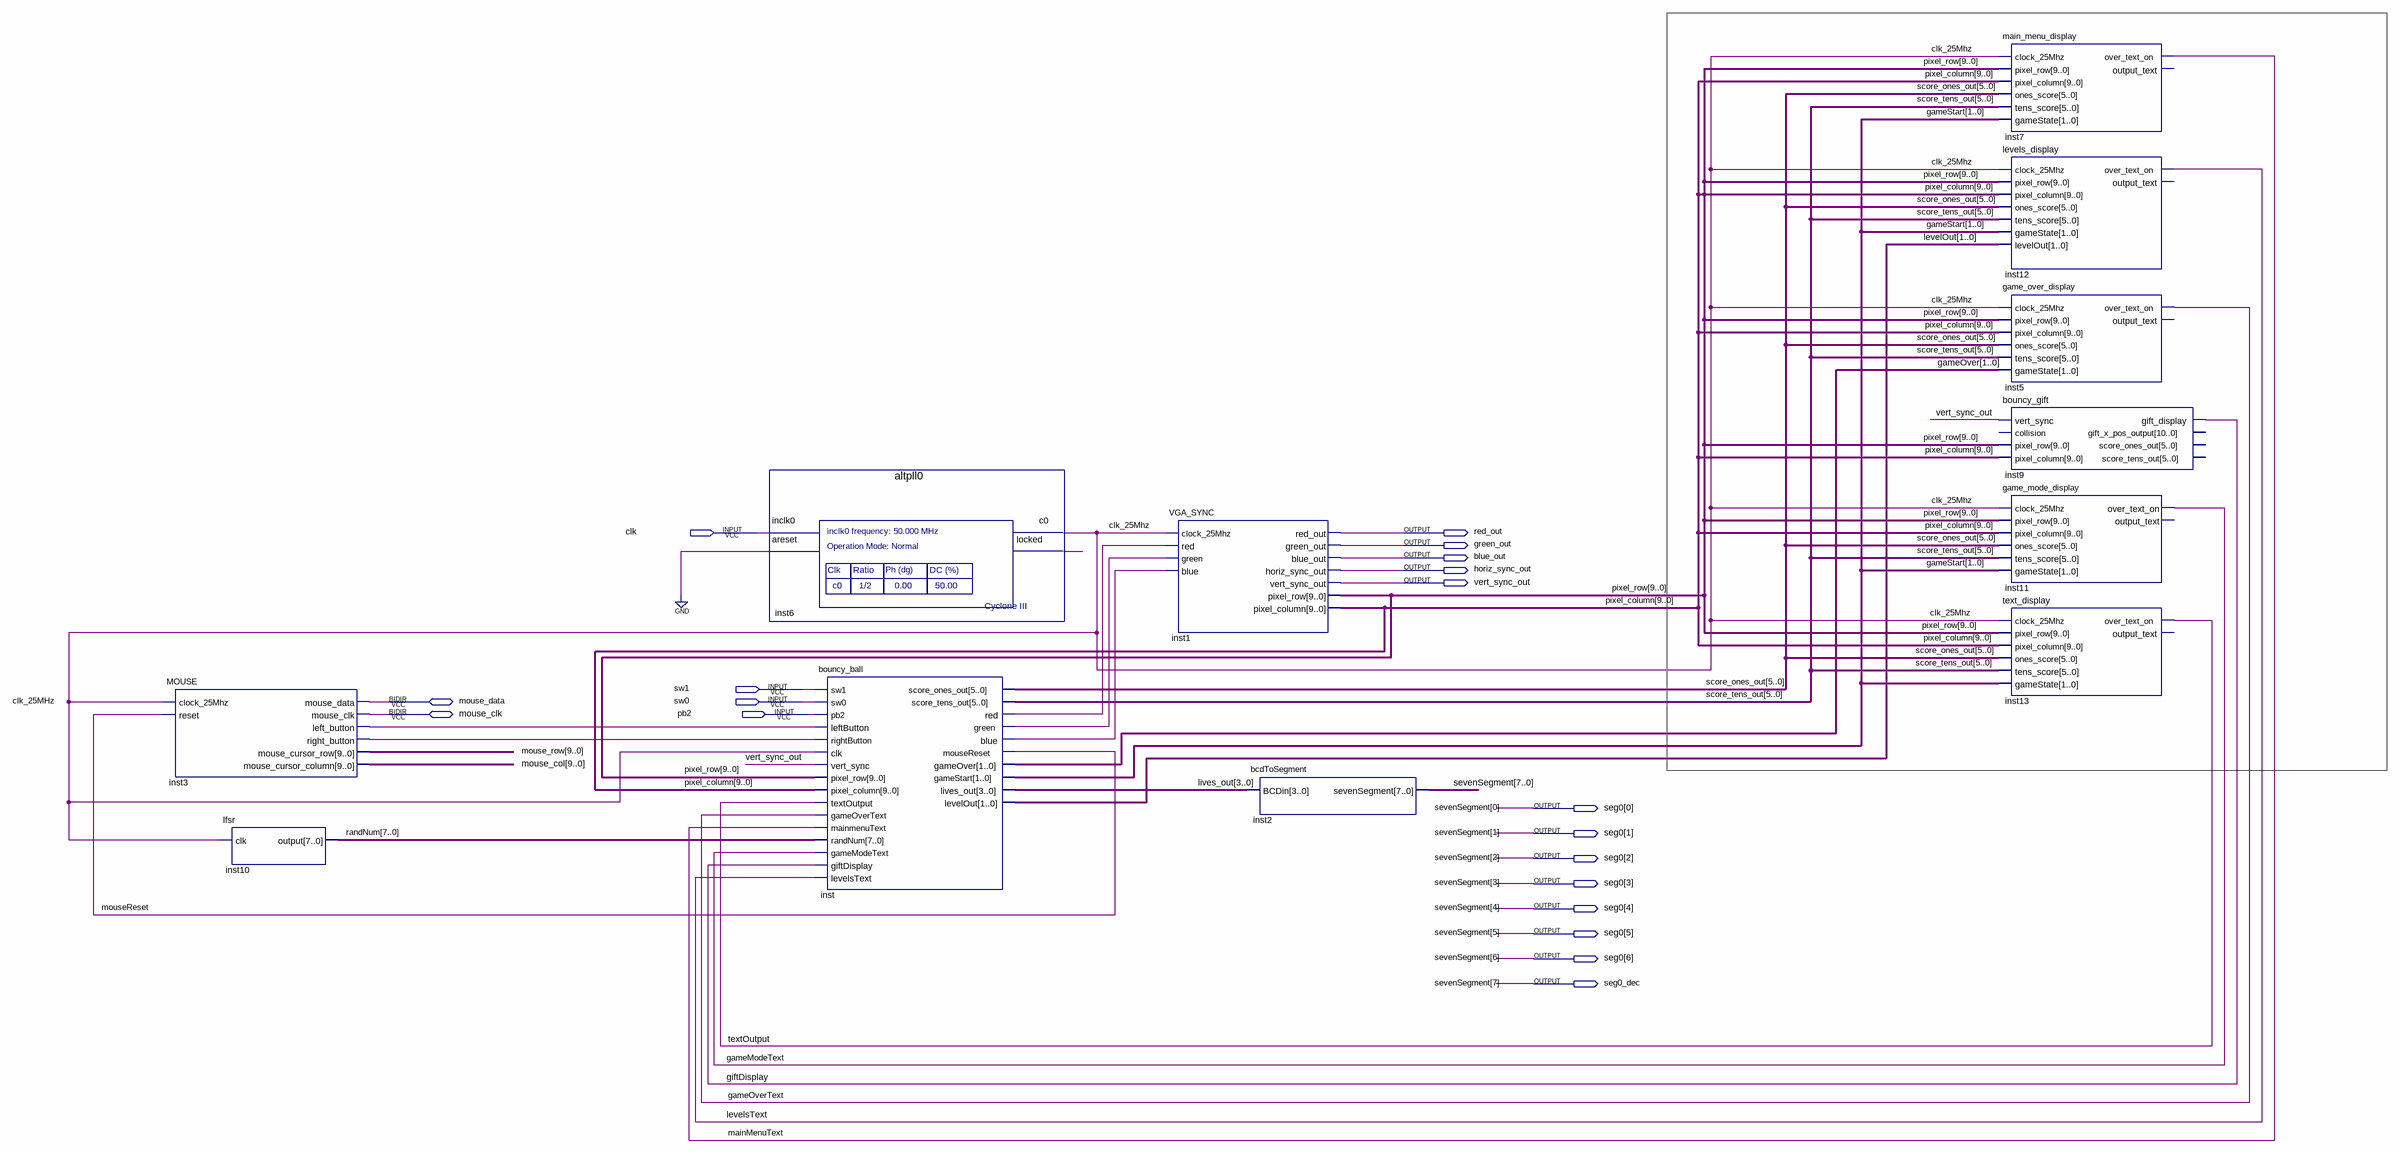
[diagram p0: schematic sheet]
// Quartus schematic mainDiagram.bdf as structural Verilog: 12 symbols, 19 pins
module mainDiagram (
  input  clk,
  input  sw1,
  input  sw0,
  input  pb2,
  inout  mouse_data,
  inout  mouse_clk,
  output red_out,
  output green_out,
  output blue_out,
  output horiz_sync_out,
  output vert_sync_out,
  output [6:0] seg0,
  output seg0_dec
);

  wire clk_25Mhz, gameModeText, gameOverText, giftDisplay, inst3_left_button, inst3_right_button,
       inst6_locked, inst_blue, inst_green, inst_red, levelsText, mainMenuText, mouseReset, textOutput;
  wire [1:0] gameOver, gameStart, levelOut;
  wire [3:0] lives_out;
  wire [5:0] score_ones_out, score_tens_out;
  wire [7:0] randNum;
  wire [9:0] mouse_col, mouse_row, pixel_column, pixel_row;

  MOUSE inst3 (
    .clock_25Mhz(clk_25Mhz), .reset(mouseReset), .left_button(inst3_left_button),
    .right_button(inst3_right_button), .mouse_cursor_row(mouse_row), .mouse_cursor_column(mouse_col),
    .mouse_data(mouse_data), .mouse_clk(mouse_clk));
  lfsr inst10 (.clk(clk_25Mhz), .\output (randNum));
  altpll0 inst6 (.inclk0(clk), .areset(1'b0), .c0(clk_25Mhz), .locked(inst6_locked));
  bouncy_ball inst (
    .sw1(sw1), .sw0(sw0), .pb2(pb2), .leftButton(inst3_left_button), .rightButton(inst3_right_button),
    .clk(clk_25Mhz), .vert_sync(vert_sync_out), .pixel_row(pixel_row), .pixel_column(pixel_column),
    .textOutput(textOutput), .gameOverText(gameOverText), .mainmenuText(mainMenuText), .randNum(randNum),
    .gameModeText(gameModeText), .giftDisplay(giftDisplay), .levelsText(levelsText),
    .score_ones_out(score_ones_out), .score_tens_out(score_tens_out), .red(inst_red), .green(inst_green),
    .blue(inst_blue), .mouseReset(mouseReset), .gameOver(gameOver), .gameStart(gameStart),
    .lives_out(lives_out), .levelOut(levelOut));
  VGA_SYNC inst1 (
    .clock_25Mhz(clk_25Mhz), .red(inst_red), .green(inst_green), .blue(inst_blue), .red_out(red_out),
    .green_out(green_out), .blue_out(blue_out), .horiz_sync_out(horiz_sync_out),
    .vert_sync_out(vert_sync_out), .pixel_row(pixel_row), .pixel_column(pixel_column));
  bcdToSegment inst2 (.BCDin(lives_out), .sevenSegment({seg0_dec, seg0}));
  main_menu_display inst7 (
    .clock_25Mhz(clk_25Mhz), .pixel_row(pixel_row), .pixel_column(pixel_column), .ones_score(score_ones_out),
    .tens_score(score_tens_out), .gameState(gameStart), .over_text_on(mainMenuText));  // open: output_text
  levels_display inst12 (
    .clock_25Mhz(clk_25Mhz), .pixel_row(pixel_row), .pixel_column(pixel_column), .ones_score(score_ones_out),
    .tens_score(score_tens_out), .gameState(gameStart), .levelOut(levelOut), .over_text_on(levelsText));  // open: output_text
  game_over_display inst5 (
    .clock_25Mhz(clk_25Mhz), .pixel_row(pixel_row), .pixel_column(pixel_column), .ones_score(score_ones_out),
    .tens_score(score_tens_out), .gameState(gameOver), .over_text_on(gameOverText));  // open: output_text
  bouncy_gift inst9 (
    .vert_sync(vert_sync_out), .pixel_row(pixel_row), .pixel_column(pixel_column), .gift_display(giftDisplay));  // open: collision, gift_x_pos_output, score_ones_out, score_tens_out
  game_mode_display inst11 (
    .clock_25Mhz(clk_25Mhz), .pixel_row(pixel_row), .pixel_column(pixel_column), .ones_score(score_ones_out),
    .tens_score(score_tens_out), .gameState(gameStart), .over_text_on(gameModeText));  // open: output_text
  text_display inst13 (
    .clock_25Mhz(clk_25Mhz), .pixel_row(pixel_row), .pixel_column(pixel_column), .ones_score(score_ones_out),
    .tens_score(score_tens_out), .gameState(gameStart), .over_text_on(textOutput));  // open: output_text

  // Other names for the same wires on the sheet: sevenSegment[7:0] = {seg0_dec, seg0}
endmodule
